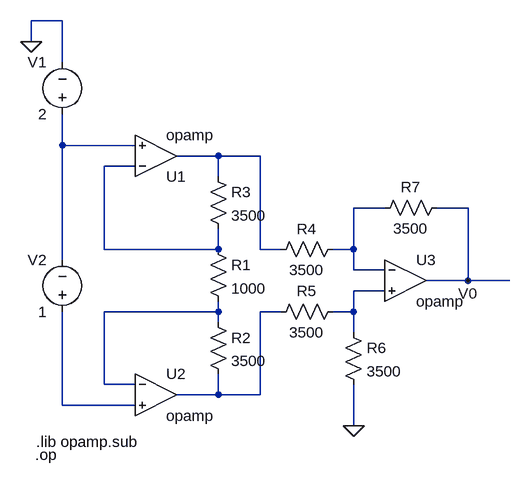
[diagram p0: schematic spicepr7.asc]
spicepr7.asc, the LTspice schematic file:
Version 4
SHEET 1 880 680
WIRE -192 -384 -240 -384
WIRE -240 -352 -240 -384
WIRE -192 -320 -192 -384
WIRE -192 -192 -192 -240
WIRE -80 -192 -192 -192
WIRE 48 -176 -16 -176
WIRE 112 -176 48 -176
WIRE -80 -160 -128 -160
WIRE 48 -144 48 -176
WIRE 304 -96 256 -96
WIRE 432 -96 384 -96
WIRE -128 -32 -128 -160
WIRE 48 -32 48 -64
WIRE 48 -32 -128 -32
WIRE 112 -32 112 -176
WIRE 144 -32 112 -32
WIRE 256 -32 256 -96
WIRE 256 -32 224 -32
WIRE -192 -16 -192 -192
WIRE 256 0 256 -32
WIRE 304 0 256 0
WIRE 432 16 432 -96
WIRE 432 16 368 16
WIRE 496 16 432 16
WIRE 304 32 256 32
WIRE 48 64 48 48
WIRE 48 64 -128 64
WIRE 144 64 112 64
WIRE 256 64 256 32
WIRE 256 64 224 64
WIRE 48 80 48 64
WIRE 256 96 256 64
WIRE -128 176 -128 64
WIRE -80 176 -128 176
WIRE 48 192 48 160
WIRE 48 192 -16 192
WIRE 112 192 112 64
WIRE 112 192 48 192
WIRE -192 208 -192 64
WIRE -80 208 -192 208
WIRE 256 240 256 176
FLAG -240 -352 0
FLAG 256 240 0
FLAG 432 16 V0
SYMBOL Opamps\\opamp -48 -112 M180
SYMATTR InstName U1
SYMBOL Opamps\\opamp -48 128 R0
SYMATTR InstName U2
SYMBOL Opamps\\opamp 336 -48 R0
SYMATTR InstName U3
SYMBOL res 32 -48 R0
SYMATTR InstName R1
SYMATTR Value 1000
SYMBOL res 32 64 R0
SYMATTR InstName R2
SYMATTR Value 3500
SYMBOL res 32 -160 R0
SYMATTR InstName R3
SYMATTR Value 3500
SYMBOL res 240 -48 R90
WINDOW 0 0 56 VBottom 2
WINDOW 3 32 56 VTop 2
SYMATTR InstName R4
SYMATTR Value 3500
SYMBOL res 240 48 R90
WINDOW 0 0 56 VBottom 2
WINDOW 3 32 56 VTop 2
SYMATTR InstName R5
SYMATTR Value 3500
SYMBOL res 240 80 R0
SYMATTR InstName R6
SYMATTR Value 3500
SYMBOL voltage -192 -224 R180
WINDOW 0 24 96 Left 2
WINDOW 3 24 16 Left 2
WINDOW 123 0 0 Left 0
WINDOW 39 0 0 Left 0
SYMATTR InstName V1
SYMATTR Value 2
SYMBOL voltage -192 80 R180
WINDOW 0 24 96 Left 2
WINDOW 3 24 16 Left 2
WINDOW 123 0 0 Left 0
WINDOW 39 0 0 Left 0
SYMATTR InstName V2
SYMATTR Value 1
SYMBOL res 400 -112 R90
WINDOW 0 0 56 VBottom 2
WINDOW 3 32 56 VTop 2
SYMATTR InstName R7
SYMATTR Value 3500
TEXT -232 264 Left 2 !.lib opamp.sub
TEXT -234 284 Left 2 !.op

The netlist it stands for:
* spicepr7.asc
XU1 N003 N001 N002 opamp Aol=100K GBW=10Meg  ; pins invin noninvin out
XU2 N006 N008 N007 opamp Aol=100K GBW=10Meg  ; pins invin noninvin out
XU3 N004 N005 V0 opamp Aol=100K GBW=10Meg  ; pins invin noninvin out
R1 N003 N006 1000
R2 N006 N007 3500
R3 N002 N003 3500
R4 N004 N002 3500
R5 N005 N007 3500
R6 N005 0 3500
V1 N001 0 2
V2 N008 N001 1
R7 V0 N004 3500
.lib opamp.sub
.op
.backanno
.end